# EAGLE design ws2812-Breakout (EAGLE 6.4)
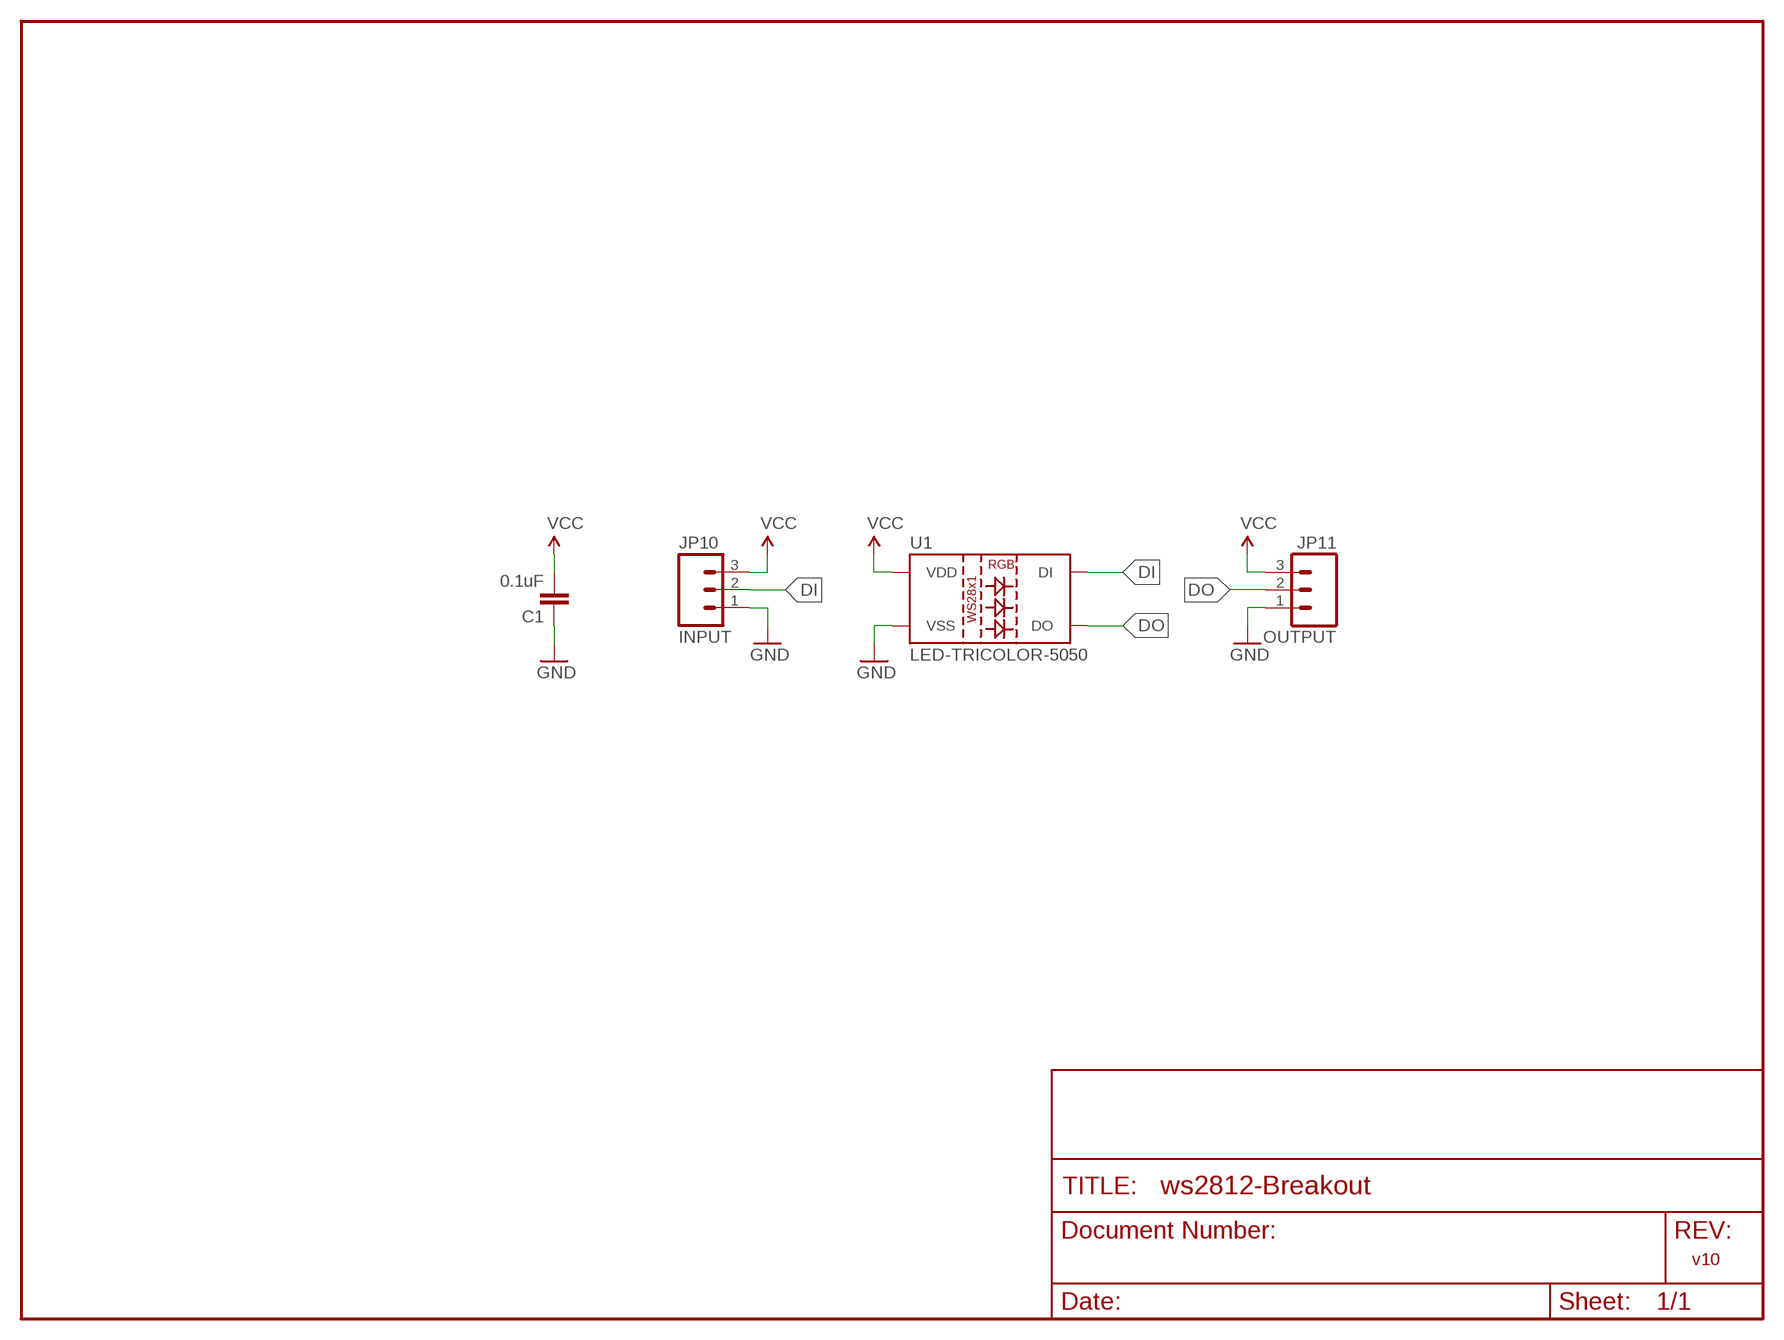
[diagram p0: schematic, sheet 1]

## Parts
C1  0.1uF  CAP0603-CAP  [0603-CAP]
JP10  INPUT  M03PTH  [1X03]
JP11  OUTPUT  M03PTH  [1X03]
U1  LED-TRICOLOR-5050  LED-TRICOLOR-5050-ICWS2811  [LED-TRICOLOR-5050-IC]

## Nets
DI: JP10.2 U1.2(DI)
DO: JP11.2 U1.1(DO)
GND: C1.1 JP10.1 JP11.1 U1.6(VSS)
VCC: C1.2 JP10.3 JP11.3 U1.3(VDD) U1.5(VDD)

## Notes on the sheet
- v10

## Library data of the parts
C1 = SparkFun:CAP: Capacitor Standard 0603 ceramic capacitor, and 0.1" leaded capacitor.
JP10 JP11 = SparkFun-Connectors:M03: Header 3 Standard 3-pin 0.1" header. Use with straight break away headers (SKU : PRT-00116), right angle break away headers (PRT-00553), swiss pins (PRT-00743), machine pins (PRT-00117), and female headers (PRT-00115). Molex polarized connector foot print use with SKU : PRT-08232 with associated crimp pins and housings.
U1 = SparkFun-LED:LED-TRICOLOR-5050-IC: 5x5mm SMD LED with built-in controller IC.

## Board
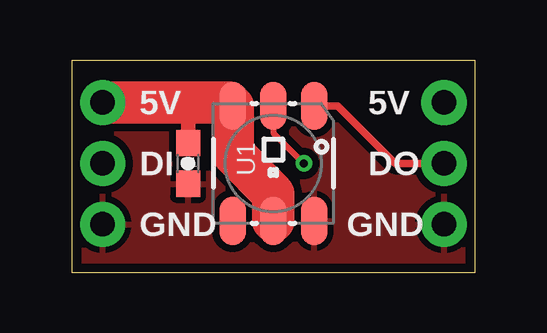
[diagram p1: board, top side]
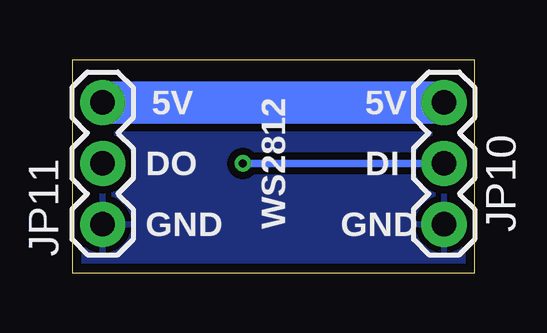
[diagram p2: board, bottom side, seen from below]

Size 16.76 x 8.89 mm. Coordinates in mm from the lower left corner, seen from the top.
Outline: 0,0 0,8.89 16.76,8.89 16.76,0 0,0
Copper layers (1*16): Top 0.0356mm / dielectric 1.5011mm / Bottom 0.0356mm
Design rules "LaenPCBOrder": minimum track width 6mil, minimum drill 13mil, track to track 6mil, track to pad 6mil, pad to pad 6mil, via to via 6mil, smd to smd 6mil, copper to edge 15mil, drill to drill 6mil, minimum pad ring 7mil, minimum via ring 7mil, stop-mask expansion 4mil, vias tented up to drill 13mil, thermal gap 10mil

### Footprints (pad centres in the part's own frame; a part is rotated, then mirrored left to right if it is on the bottom)
0603-CAP = smd 1.1 x 1: 1 -0.85,0; 2 0.85,0
1X03 = drill 1.016 pad 1.88: 1 0,0; 2 2.54,0; 3 5.08,0
LED-TRICOLOR-5050-IC = smd 2 x 1.1: 1 -2.4,1.7; 2 -2.4,0; 3 -2.4,-1.7; 4 2.4,-1.7; 5 2.4,0; 6 2.4,1.7

### Placement (x,y rotation side)
C1  4.83,4.57 90 top
JP10  1.27,2.03 90 bottom
JP11  15.49,2.03 90 bottom
U1  8.38,4.57 270 top

### Tracks (layer width: path | path; a pad name or v marks a point on that pad's centre or on a via)
DI  (via drill 0.33)
  Top 0.254: U1.2 8.38,5.84 v9.65,4.57
  Bottom 0.305: JP10.2 v9.65,4.57
DO
  Top 0.305: U1.1 11.06,6.97 13.46,4.57 JP11.2
GND
  pour Top (isolate 0.305): 0,8.89 0,0 16.76,0 16.76,8.89
  pour Bottom (isolate 0.305): 0,8.89 0,0 16.76,0 16.76,8.89
VCC
  Top 0.254: 6.6,7.11 U1.3
  Top 0.61: C1.2 4.83,7.11
  Top 1.778: 5.84,7.11 4.83,7.11 JP10.3 | 5.84,7.11 6.54,7.11 | U1.5 8.38,3.3 6.68,5 U1.3 5.84,7.11
  Bottom 1.778: JP10.3 JP11.3

### Text on the board
tPlace: 5V | 5V | DI | DO | GND | GND
bPlace: 5V | 5V | DI | DO | GND | GND
bNames: WS2812
Document: N. Seidle